# EAGLE design jevois_com (EAGLE 8.4.1)
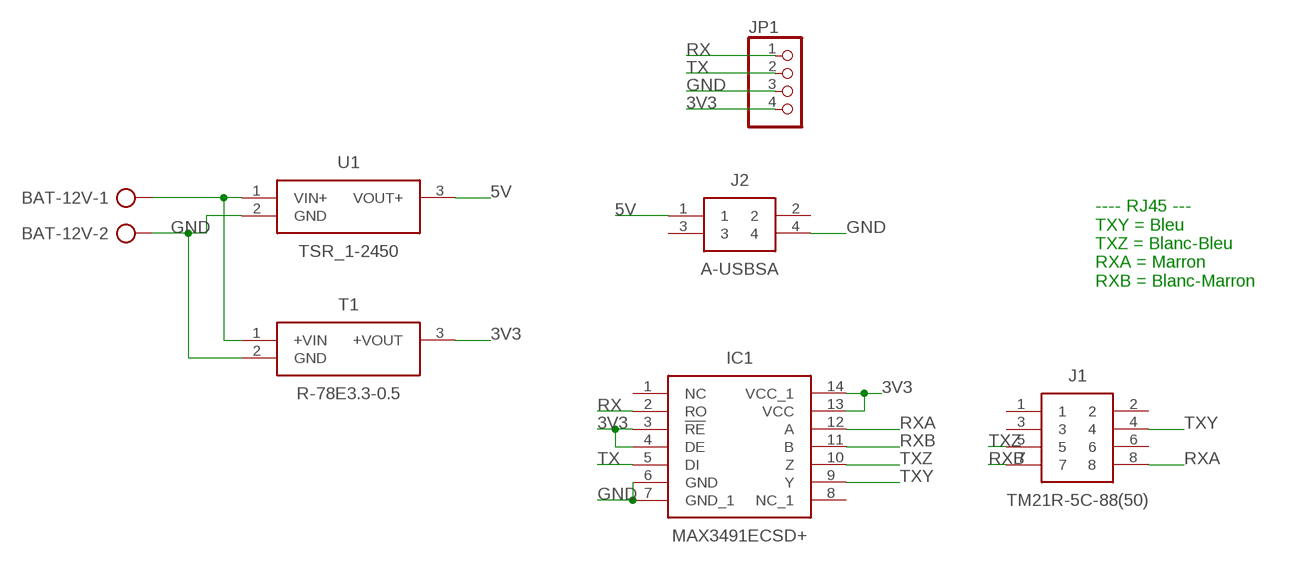
[diagram p0: schematic, sheet 1]

## Parts
BAT-12V  AK500/2-H  [AK500/2-H]
IC1  MAX3491ECSD+  [SOIC127P600X175-14N]
J1  TM21R-5C-88(50)  [TM21R-5C-88(50)]
J2  A-USBSA  [A-USBSA]
JP1  PINHD-1X4  [1X04]
T1  R-78E3.3-0.5  [SHDRV3W100P0_254_1X3_1160X850X]
U1  TSR_1-2450  [TSR-1-24120]

## Nets
3V3: IC1.3(!RE) IC1.4(DE) IC1.13(VCC) IC1.14(VCC_1) JP1.4 T1.3(+VOUT)
5V: J2.1 U1.3(VOUT+)
GND: BAT-12V.2 IC1.6(GND) IC1.7(GND_1) J2.4 JP1.3 T1.2(GND) U1.2(GND)
N$2: BAT-12V.1 T1.1(+VIN) U1.1(VIN+)
RX: IC1.2(RO) JP1.1
RXA: IC1.12(A) J1.8
RXB: IC1.11(B) J1.7
TX: IC1.5(DI) JP1.2
TXY: IC1.9(Y) J1.4
TXZ: IC1.10(Z) J1.5
Unconnected: IC1.1(NC) IC1.8(NC_1) J1.1 J1.2 J1.3 J1.6 J2.2 J2.3

## Notes on the sheet
- ---- RJ45 ---
  TXY = Bleu
  TXZ = Blanc-Bleu
  RXA = Marron
  RXB = Blanc-Marron

## Library data of the parts
BAT-12V = con-ptr500:AK500/2-H: CONNECTOR Aug. 2004 / PTR Meßtechnik: Die Bezeichnung der Serie AK505 wurde geändert. Es handelt sich hierbei um AK500 in horizontaler Ausführung.; OC_FARNELL: unknown; OC_NEWARK: unknown
IC1 = SamacSys_Parts:MAX3491ECSD+: MAX3491ECSD+, Line Transceiver, RS-485, RS-422 15 Mbit/s Differential, 3.3 V, 14-Pin SOIC <https://componentsearchengine.com/Images/1/MAX3491ECSD%2B.jpg> Source: Datasheet <http://docs-europe.electrocomponents.com/webdocs/0f63/0900766b80f63332.pdf>; DESCRIPTION: MAX3491ECSD+, Line Transceiver, RS-485, RS-422 15 Mbit/s Differential, 3.3 V, 14-Pin SOIC; HEIGHT: 1.75mm; MANUFACTURER_NAME: Maxim Integrated; MANUFACTURER_PART_NUMBER: MAX3491ECSD+; RS_PART_NUMBER: 7329496; SUPPLIER_NAME: RS
J1 = SamacSys_Parts:TM21R-5C-88(50): 8 way Cat6 shielded RJ45 PCB socket,1.5A Hirose Cat5e RJ45 Connector Socket, STP, Right Angle, Through Hole <https://componentsearchengine.com/Images/3/TM21R-5C-88%2850%29.jpg> Source: Datasheet <https://www.hirose.com/product/en/download_file/key_name/TM21R-5C-88-LP(50)/category/Drawing (2D)/doc_file_id/79045/?file_category_id=6&item_id=02222892050&is_series=>; DESCRIPTION: 8 way Cat6 shielded RJ45 PCB socket,1.5A Hirose Cat5e RJ45 Connector Socket, STP, Right Angle, Through Hole; HEIGHT: mm; MANUFACTURER_NAME: Hirose; MANUFACTURER_PART_NUMBER: TM21R-5C-88(50); RS_PART_NUMBER: 6256710; SUPPLIER_NAME: RS
J2 = SamacSys_Parts:A-USBSA: USB A type DIP ASSMANN WSW Female 1 port Right Angle Through Hole Type A USB Connector <https://componentsearchengine.com/Images/3/A-USBSA.jpg> Source: Datasheet <http://docs-europe.electrocomponents.com/webdocs/1362/0900766b81362a86.pdf>; DESCRIPTION: USB A type DIP ASSMANN WSW Female 1 port Right Angle Through Hole Type A USB Connector; HEIGHT: mm; MANUFACTURER_NAME: ASSMANN WSW components GmbH; MANUFACTURER_PART_NUMBER: A-USBSA; RS_PART_NUMBER: 6741325P; SUPPLIER_NAME: RS
JP1 = pinhead:PINHD-1X4: PIN HEADER
T1 = SamacSys_Parts:R-78E3.3-0.5: Switching Regulator 6-28Vin 3.3Vout 0.5A Switching Regulator, 6 <https://componentsearchengine.com/Images/3/R-78E3.3-0.5.jpg> Source: Datasheet <http://www.recom-power.com/pdf/Innoline/R-78Exx-0.5.pdf>; DESCRIPTION: Switching Regulator 6-28Vin 3.3Vout 0.5A Switching Regulator, 6; HEIGHT: mm; MANUFACTURER_NAME: RECOM Power; MANUFACTURER_PART_NUMBER: R-78E3.3-0.5; RS_PART_NUMBER: 7773291; SUPPLIER_NAME: RS
U1 = SamacSys_Parts:TSR_1-2450: Switching Regulator,6.5-32Vin,5Vout 1A Switching Regulator, 6.5 ??? 36V dc Input, 5V Output, 1A <https://componentsearchengine.com/Images/1/TSR+1-2450.jpg> Source: Datasheet <http://assets.tracopower.com/20160301160144/TSR1/documents/tsr1-datasheet.pdf>; DESCRIPTION: Switching Regulator,6.5-32Vin,5Vout 1A Switching Regulator, 6.5 ??? 36V dc Input, 5V Output, 1A; HEIGHT: mm; MANUFACTURER_NAME: Traco Power; MANUFACTURER_PART_NUMBER: TSR 1-2450; RS_PART_NUMBER: 6664379P; SUPPLIER_NAME: RS

## Board
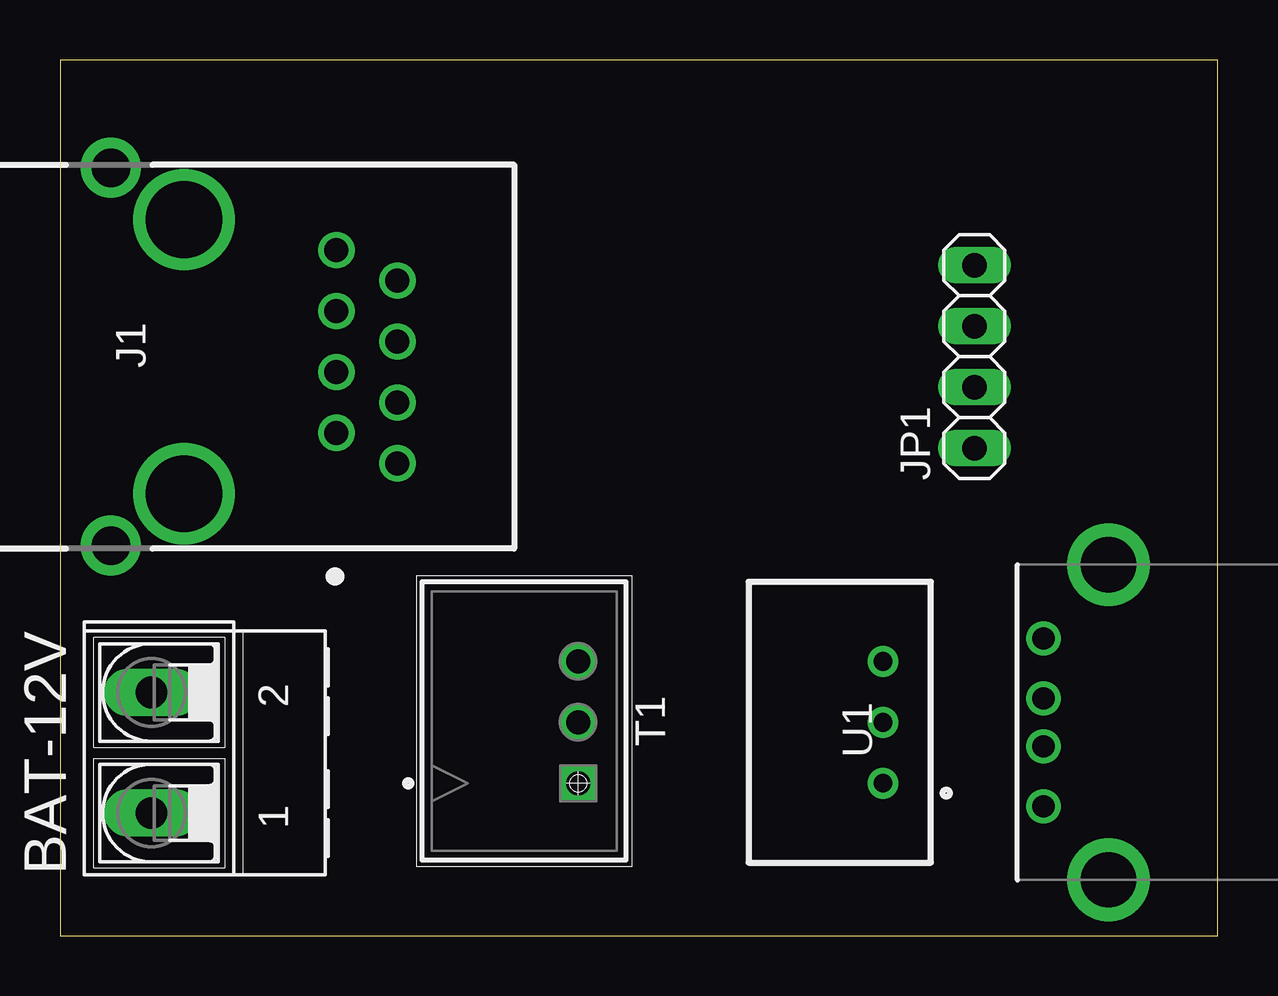
[diagram p1: board, top side]
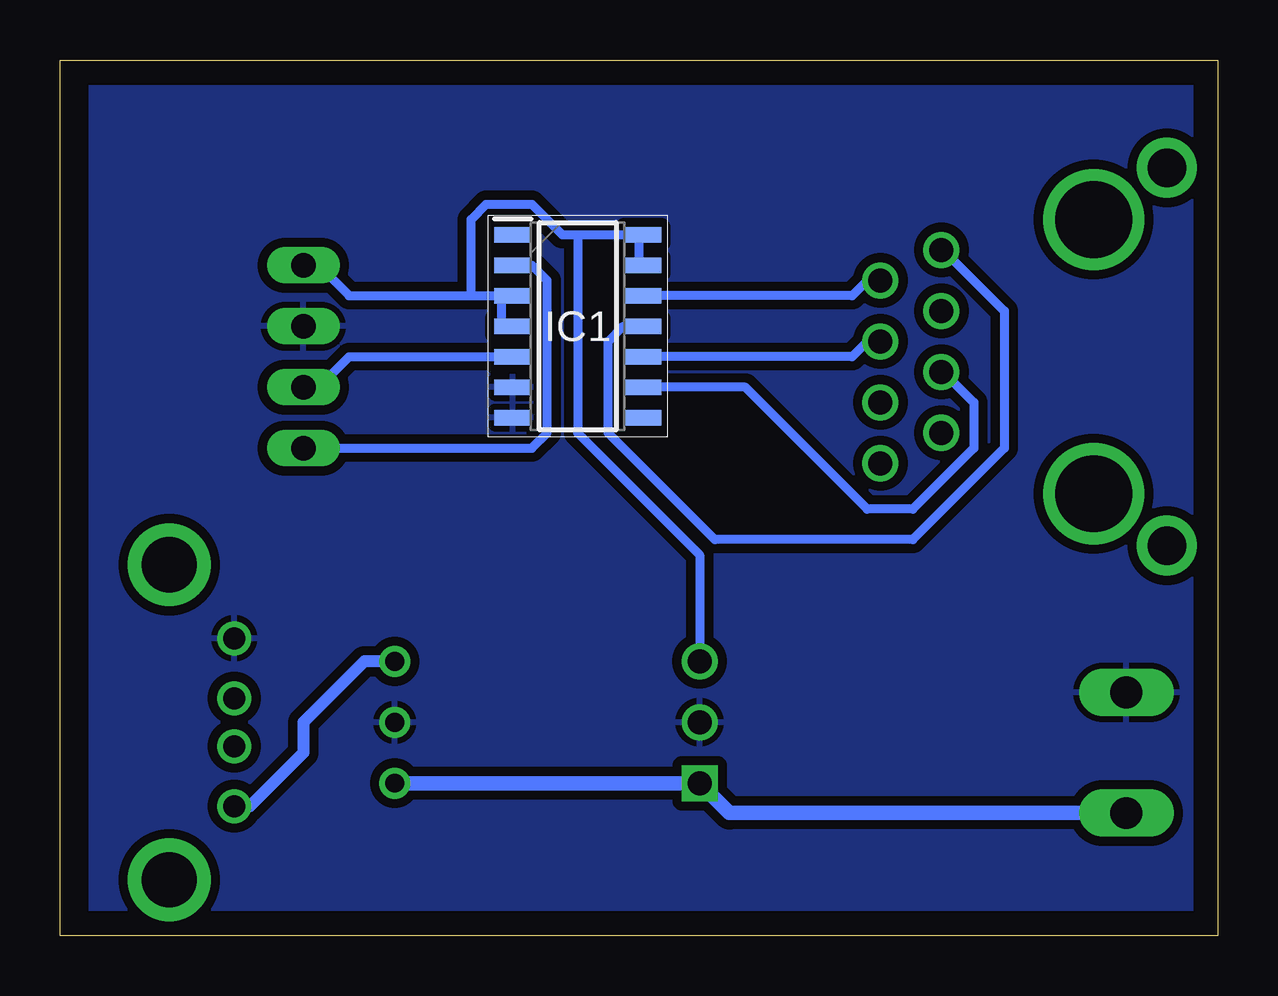
[diagram p2: board, bottom side, seen from below]

Size 48.24 x 36.5 mm. Coordinates in mm from the lower left corner, seen from the top.
Outline: 0,0 48.24,0 48.24,36.5 0,36.5 0,0
Copper layers (1*16): Top 0.035mm / dielectric 1.5mm / Bottom 0.035mm
Design rules "base": minimum track width 15mil, minimum drill 0.35mm, track to track 15mil, track to pad 15mil, pad to pad 15mil, via to via 6mil, smd to smd 6mil, copper to edge 40mil, drill to drill 6mil, minimum pad ring 10mil, minimum via ring 8mil, stop-mask expansion 4mil, vias tented up to drill 0mil, thermal gap 10mil

### Footprints (pad centres in the part's own frame; a part is rotated, then mirrored left to right if it is on the bottom)
AK500/2-H = drill 1.321 long: 1 -2.515,0; 2 2.515,0
SOIC127P600X175-14N = smd 1.525 x 0.65: 1 -2.712,3.81; 2 -2.712,2.54; 3 -2.712,1.27; 4 -2.712,0; 5 -2.712,-1.27; 6 -2.712,-2.54; 7 -2.712,-3.81; 8 2.712,-3.81; 9 2.712,-2.54; 10 2.712,-1.27; 11 2.712,0; 12 2.712,1.27; 13 2.712,2.54; 14 2.712,3.81
TM21R-5C-88(50) = drill 1 pad 1.5: 1 3.175,16.6; 2 4.445,19.14; 3 1.905,19.14; 4 0.635,16.6; 5 -0.635,19.14; 6 -1.905,16.6; 7 -4.445,16.6; 8 -3.175,19.14 | drill 3.2 pad 3.2: 9 -5.715,10.25; 10 5.715,10.25 | drill 1.6 pad 2.5: 11 -7.875,7.2; 12 7.875,7.2
A-USBSA = drill 0.92 pad 1.38: 1 -3.5,6.01; 2 -1,6.01; 3 1,6.01; 4 3.5,6.01 | drill 2.3 pad 3.45: 5 -6.57,3.3; 6 6.57,3.3
1X04 = drill 1.016 long: 1 -3.81,0; 2 -1.27,0; 3 1.27,0; 4 3.81,0
SHDRV3W100P0_254_1X3_1160X850X = drill 1 pad 1.5 square: 1 0,0 | drill 1 pad 1.5: 2 2.54,0; 3 5.08,0
TSR-1-24120 = drill 0.78 pad 1.28: 1 -2.54,0; 2 0,0; 3 2.54,0

### Placement (x,y rotation side)
BAT-12V  3.81,7.62 90 top
IC1  26.67,25.4 0 bottom
J1  -5.08,24.13 270 top
J2  46.99,8.89 90 top
JP1  38.1,24.13 90 top
T1  21.59,6.35 90 top
U1  34.29,8.89 90 top

### Tracks (layer width: path | path; a pad name or v marks a point on that pad's centre or on a via)
3V3
  Bottom 0.381: 24.13,29.21 24.13,27.94 IC1.13 | 29.84,26.67 29.84,25.4 IC1.4 | 31.11,26.67 36.2,26.67 37.47,27.94 JP1.4 | 31.11,26.67 29.84,26.67 | 29.84,26.67 IC1.3 | 26.67,29.21 27.3,29.21 28.57,30.48 30.48,30.48 31.11,29.84 31.11,26.67 | 26.67,29.21 24.13,29.21 | 24.13,29.21 IC1.14 | T1.3 21.59,15.88 26.67,20.95 26.67,29.21
5V
  Bottom 0.381: J2.1 40.64,5.08
  Bottom 0.508: U1.3 35.56,11.43 38.1,8.89 38.1,7.62 40.33,5.39 J2.1
GND
  pour Bottom: 0,0 0,35.56 46.99,35.56 46.99,0
N$2
  Bottom 0.381: 20.95,5.71 T1.1 | 3.81,5.71 BAT-12V.1
  Bottom 0.61: BAT-12V.1 20.34,5.11 T1.1 U1.1
RX
  Bottom 0.381: IC1.2 28.57,27.94 27.94,27.3 27.94,20.95 28.57,20.32 JP1.1
RXA
  Bottom 0.381: IC1.12 15.24,26.67 14.61,27.3 J1.8
RXB
  Bottom 0.381: IC1.11 24.77,25.4 25.4,24.77 25.4,20.95 20.95,16.51 12.7,16.51 8.89,20.32 8.89,26.04 11.43,28.57 J1.7
TX
  Bottom 0.381: IC1.5 36.2,24.13 37.47,22.86 JP1.2
TXY
  Bottom 0.381: IC1.9 19.68,22.86 14.61,17.78 12.7,17.78 10.16,20.32 10.16,22.23 11.43,23.5 J1.4
TXZ
  Bottom 0.381: IC1.10 15.24,24.13 14.61,24.77 J1.5